# Altium schematic sheet eps32&lora.SchDoc
size A3
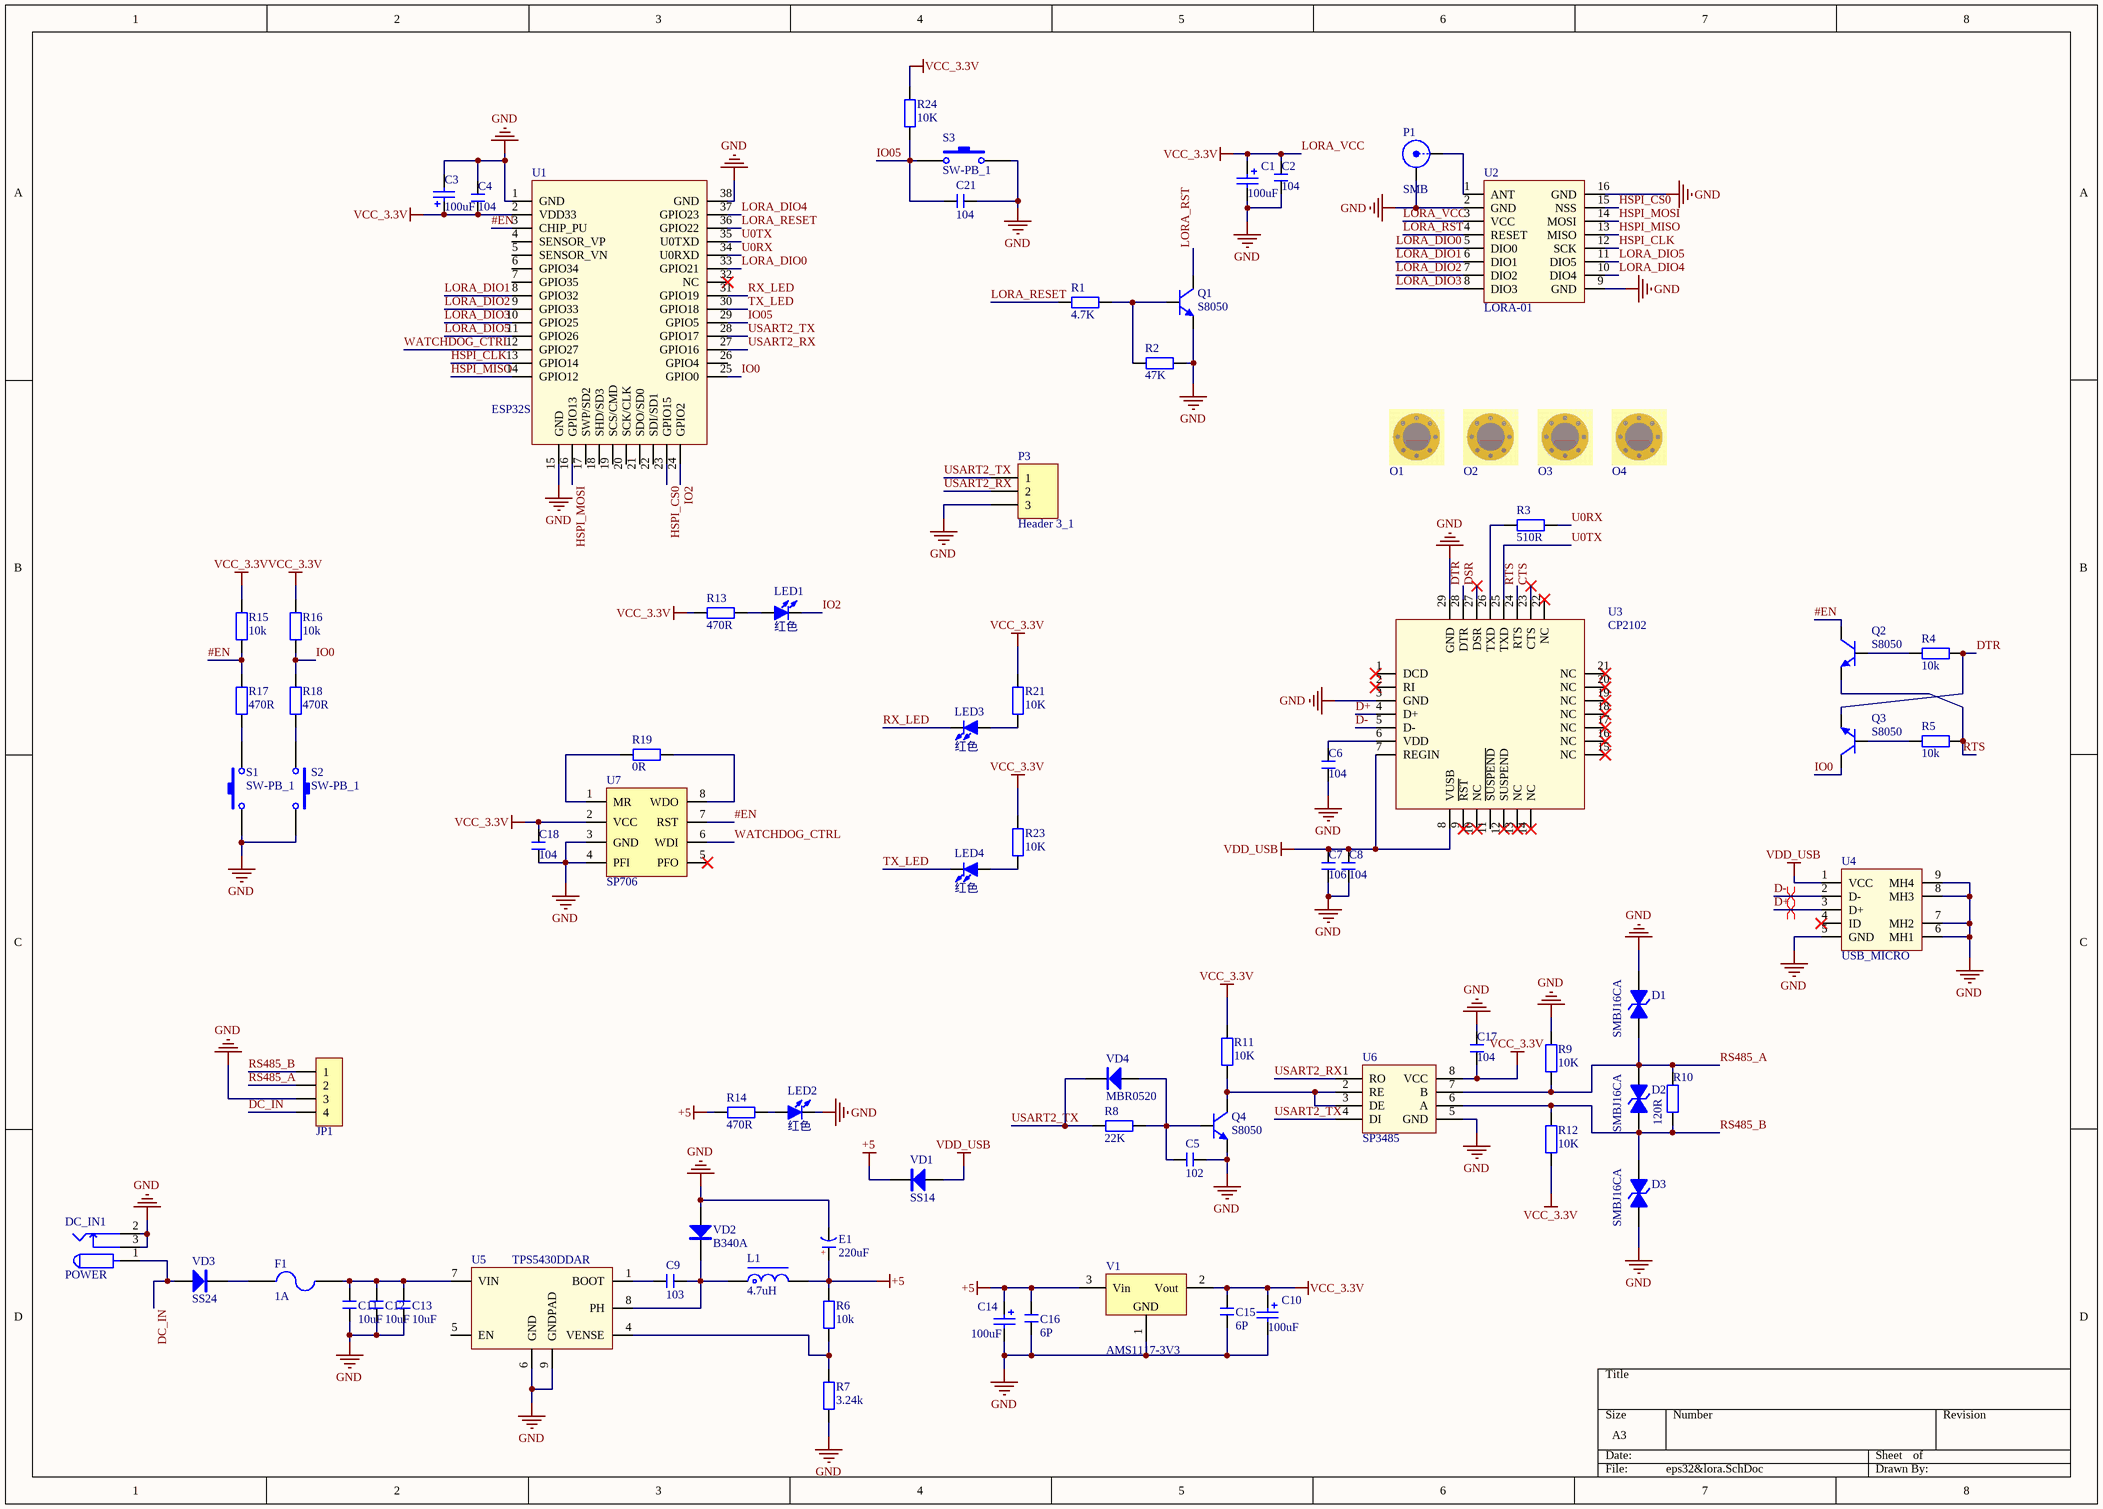
[diagram p0: eps32&lora.SchDoc]

## Parts
C1  100uF  [TAN_SMB]
C2  104  [C 0603]
C3  100uF  [TAN_SMB]
C4  104  [C 0603]
C5  102  [C 0603]
C6  104  [C 0603]
C7  106  [C 0603]
C8  104  [C 0603]
C9  103  [C 0603]
C10  100uF  [TAN_SMB]
C11  10uF  [C 1206]
C12  10uF  [C 1206]
C13  10uF  [C 1206]
C14  100uF  [TAN_SMB]
C15  6P  [C 0603]
C16  6P  [C 0603]
C17  104  [C 0603]
C18  104  [C 0603]
C21  104  [C 0603]
D1  SMBJ16CA  [D_SMB]
D2  SMBJ16CA  [D_SMB]
D3  SMBJ16CA  [D_SMB]
DC_IN1  POWER  [DC_5.5MM]
E1  220uF  [CM D(6.3*7.7)]
F1  1A  [L 1206]
JP1  HDR-1X4  [HDR5.08mm-4P]  (value not drawn)
L1  4.7uH  [L_SMD]
LED1  红色  [LED_3MM]
LED2  红色  [LED_3MM]
LED3  红色  [LED_3MM]
LED4  红色  [LED_3MM]
O1  O  [KONG3MM]  (value not drawn)
O2  O  [KONG3MM]  (value not drawn)
O3  O  [KONG3MM]  (value not drawn)
O4  O  [KONG3MM]  (value not drawn)
P1  SMB  [SMB_V-RJ45]
P3  Header 3_1  [HDR1X3]
Q1  S8050  [SOT23-3L]
Q2  S8050  [SOT23-3L]
Q3  S8050  [SOT23-3L]
Q4  S8050  [SOT23-3L]
R1  4.7K  [R 0603]
R2  47K  [R 0603]
R3  510R  [R 0603]
R4  10k  [R 0603]
R5  10k  [R 0603]
R6  10k  [R 0603]
R7  3.24k  [R 0603]
R8  22K  [R 0603]
R9  10K  [R 0603]
R10  120R  [R 0603]
R11  10K  [R 0603]
R12  10K  [R 0603]
R13  470R  [R 0603]
R14  470R  [R 0603]
R15  10k  [R 0603]
R16  10k  [R 0603]
R17  470R  [R 0603]
R18  470R  [R 0603]
R19  0R  [R 0603]
R21  10K  [R 0603]
R23  10K  [R 0603]
R24  10K  [R 0603]
S1  SW-PB_1  [SW_3P]
S2  SW-PB_1  [SW_3.6*2.5]
S3  SW-PB_1  [SW_3P]
U1  ESP32S  [ESP-32S]
U2  LORA-01  [LORA-01]
U3  CP2102  [QFN28]
U4  USB_MICRO  [USB_MICRO_5S_B]
U5  TPS5430DDAR  [SOIC8_VIALPAD]
U6  SP3485  [MAX485]
U7  SP706  [SOIC8]
V1  AMS1117-3V3  [SOT223_L]
VD1  SS14  [D_SMA]
VD2  B340A  [D_SMA]
VD3  SS24  [D_SMB]
VD4  MBR0520  [SOD-123]

## Nets
+5: C14.1 C16.2 E1.1(A) L1.2 R6.2 R14.1 V1.3(Vin) VD1.2(K)
GND: C1.2 C2.1 C3.2 C4.1 C5.1 C6.1 C7.2 C8.1 C10.2 C11.1 C12.1 C13.1 C14.2 C15.1 C16.1 C17.2 C18.2 C21.1 D1.2 D3.1(A) DC_IN1.2 DC_IN1.3 E1.2(K) JP1.3 LED2.2(K) P1.2(Y) P3.3 Q1.2(E) Q4.2(E) R2.1 R7.1 R9.2 S1.1 S2.2 S3.2 U1.1(GND) U1.15(GND) U1.38(GND) U2.2(GND) U2.9(GND) U2.16(GND) U3.3(GND) U3.29(GND) U4.5(GND) U4.6(MH1) U4.7(MH2) U4.8(MH3) U4.9(MH4) U5.6(GND) U5.9(GNDPAD) U6.5(GND) U7.3(GND) U7.4(PFI) V1.1(GND) VD2.1(A)
LORA_VCC: C1.1 C2.2 C3.1 C4.2 C10.1 C15.2 C17.1 C18.1 R11.1 R12.1 R13.1 R15.1 R16.1 R21.1 R23.1 R24.1 U1.2(VDD33) U2.3(VCC) U6.8(VCC) U7.2(VCC) V1.2(Vout)  [also labelled VCC_3.3V]
VDD_USB: C7.1 C8.2 U3.7(REGIN) U3.8(VUSB) U4.1(VCC) VD1.1(A)
#EN: Q2.3(C) R15.2 R17.2 U1.3(CHIP_PU) U7.7(RST)
CTS: U3.23(CTS)
D+: U3.4(D+) U4.3(D+)
D-: U3.5(D-) U4.2(D-)
DC_IN: DC_IN1.1 JP1.4 VD3.1(A)
DSR: U3.27(DSR)
DTR: Q3.2(E) R4.1 U3.28(DTR)
HSPI_CLK: U1.13(GPIO14) U2.12(SCK)
HSPI_CS0: U1.23(GPIO15) U2.15(NSS)
HSPI_MISO: U1.14(GPIO12) U2.13(MISO)
HSPI_MOSI: U1.16(GPIO13) U2.14(MOSI)
IO0: Q3.3(C) R16.2 R18.2 U1.25(GPIO0)
IO2: LED1.2(K) U1.24(GPIO2)
IO05: C21.2 R24.2 S3.1 U1.29(GPIO5)
LORA_DIO0: U1.33(GPIO21) U2.5(DIO0)
LORA_DIO1: U1.8(GPIO32) U2.6(DIO1)
LORA_DIO2: U1.9(GPIO33) U2.7(DIO2)
LORA_DIO3: U1.10(GPIO25) U2.8(DIO3)
LORA_DIO4: U1.37(GPIO23) U2.10(DIO4)
LORA_DIO5: U1.11(GPIO26) U2.11(DIO5)
LORA_RESET: R1.2 U1.36(GPIO22)
LORA_RST: Q1.3(C) U2.4(RESET)
RS485_A: D1.1(A) D2.2 JP1.2 R9.1 R10.2 U6.7(B)
RS485_B: D2.1(A) D3.2 JP1.1 R10.1 R12.2 U6.6(A)
RTS: Q2.2(E) R5.1 U3.24(RTS)
RX_LED: LED3.2(K) U1.31(GPIO19)
TX_LED: LED4.2(K) U1.30(GPIO18)
U0RX: R3.1 U1.34(U0RXD)
U0TX: U1.35(U0TXD) U3.25(TXD)
USART2_RX: P3.2 U1.27(GPIO16) U6.1(RO)
USART2_TX: P3.1 R8.1 U1.28(GPIO17) U6.4(DI) VD4.2(K)
WATCHDOG_CTRL: U1.12(GPIO27) U7.6(WDI)
NetC5_2: C5.2 Q4.1(B) R8.2 VD4.1(A)
NetC6_2: C6.2 U3.6(VDD)
NetC9_1: C9.1 U5.1(BOOT)
NetC9_2: C9.2 L1.1 U5.8(PH) VD2.2(K)
NetC11_2: C11.2 C12.2 C13.2 F1.1 U5.7(VIN)
NetF1_2: F1.2 VD3.2(K)
NetLED1_1: LED1.1(A) R13.2
NetLED2_1: LED2.1(A) R14.2
NetLED3_1: LED3.1(A) R21.2
NetLED4_1: LED4.1(A) R23.2
NetP1_1: P1.1(X) U2.1(ANT)
NetQ1_1: Q1.1(B) R1.1 R2.2
NetQ2_1: Q2.1(B) R4.2
NetQ3_1: Q3.1(B) R5.2
NetQ4_3: Q4.3(C) R11.2 U6.2(RE) U6.3(DE)
NetR3_2: R3.2 U3.26(TXD)
NetR6_1: R6.1 R7.2 U5.4(VENSE)
NetR17_1: R17.1 S1.2
NetR18_1: R18.1 S2.1
NetR19_1: R19.1 U7.1(MR)
NetR19_2: R19.2 U7.8(WDO)

Not connected (* = marked no-connect by the designer): U1 4(SENSOR_VP) 5(SENSOR_VN) 6(GPIO34) 7(GPIO35) 17(SWP/SD2) 18(SHD/SD3) 19(SCS/CMD) 20(SCK/CLK) 21(SDO/SD0) 22(SDI/SD1) 26(GPIO4) 32(NC)*; U3 1(DCD)* 2(RI)* 9(~{RST})* 10(NC)* 11(~{SUSPEND}) 12(SUSPEND)* 13(NC)* 14(NC)* 15(NC)* 16(NC)* 17(NC)* 18(NC)* 19(NC)* 20(NC)* 21(NC)* 22(NC)*; U4 4(ID)*; U5 5(EN); U7 5(PFO)*

## Layout directives
differential pair: D+, D-

## Notes on the sheet
- (in symbol C-CAP) +

## Library data of the parts
C1 C3 C10 C14 = CAP_TAN
C2 C4-C9 C11-C13 C15-C18 C21 = C: 无极性贴片电容; 版权归属: 源创客; BOM名称: 无极性贴片电容; 学习资源: www.ooocke.com
D1-D3 = 双向TVS
DC_IN1 = POW
E1 = C-CAP: 直插电解电容; 版权归属: 源创客; BOM名称: 直插电解电容; 学习资源: www.ooocke.com
F1 = FU 5x20: 5*20保险丝; 版权归属: 源创客; BOM名称: 5*20保险丝; 学习资源: www.ooocke.com
JP1 = Header 4: 4P接插件; 版权归属: 源创客; BOM名称: 4P接插件; 学习资源: www.ooocke.com
L1 = L: 小功率贴片电感; 版权归属: 源创客; BOM名称: 小功率贴片电感; 学习资源: www.ooocke.com
LED1-LED4 = LED-5MM: 5mm插件LED; 版权归属: 源创客; BOM名称: 5mm插件LED; 学习资源: www.ooocke.com
P1 = SMB: SMB Straight Connector; LatestRevisionDate: 17-Jul-2002; LatestRevisionNote: Re-released for DXP Platform.; Publisher: Altium Limited
P3 = Header 3_1: Header, 3-Pin; LatestRevisionDate: 17-Jul-2002; LatestRevisionNote: Re-released for DXP Platform.; Publisher: Altium Limited
Q1-Q4 = 8050-SMD: 高频放大-NPN型; 版权归属: 源创客; 属性: 40V 1.5A 1W 100MHZ; BOM名称: 高频放大-NPN型; 学习资源: www.ooocke.com
R1-R19 R21 R23 R24 = R: 贴片电阻; 版权归属: 源创客; BOM名称: 贴片电阻; 学习资源: www.ooocke.com
S1-S3 = SW-PB_1: Switch; Published: 24-Mar-1999; LatestRevisionDate: 17-Jul-2002; LatestRevisionNote: Re-released for DXP Platform.; PackageReference: SPST-2; Publisher: Altium Limited
U6 = MAX485
V1 = AMS1117: 三端稳压芯片; BOM名称: 稳压芯片; 版权归属: 源创客; 学习资源: www.ooocke.com
VD1-VD4 = SS14: 肖特基二极管; 版权归属: 源创客; 属性: 40V/1A; BOM名称: 肖特基二极管; 学习资源: www.ooocke.com